# EAGLE schematic Alimentatore_Banco (EAGLE 9.5.0)
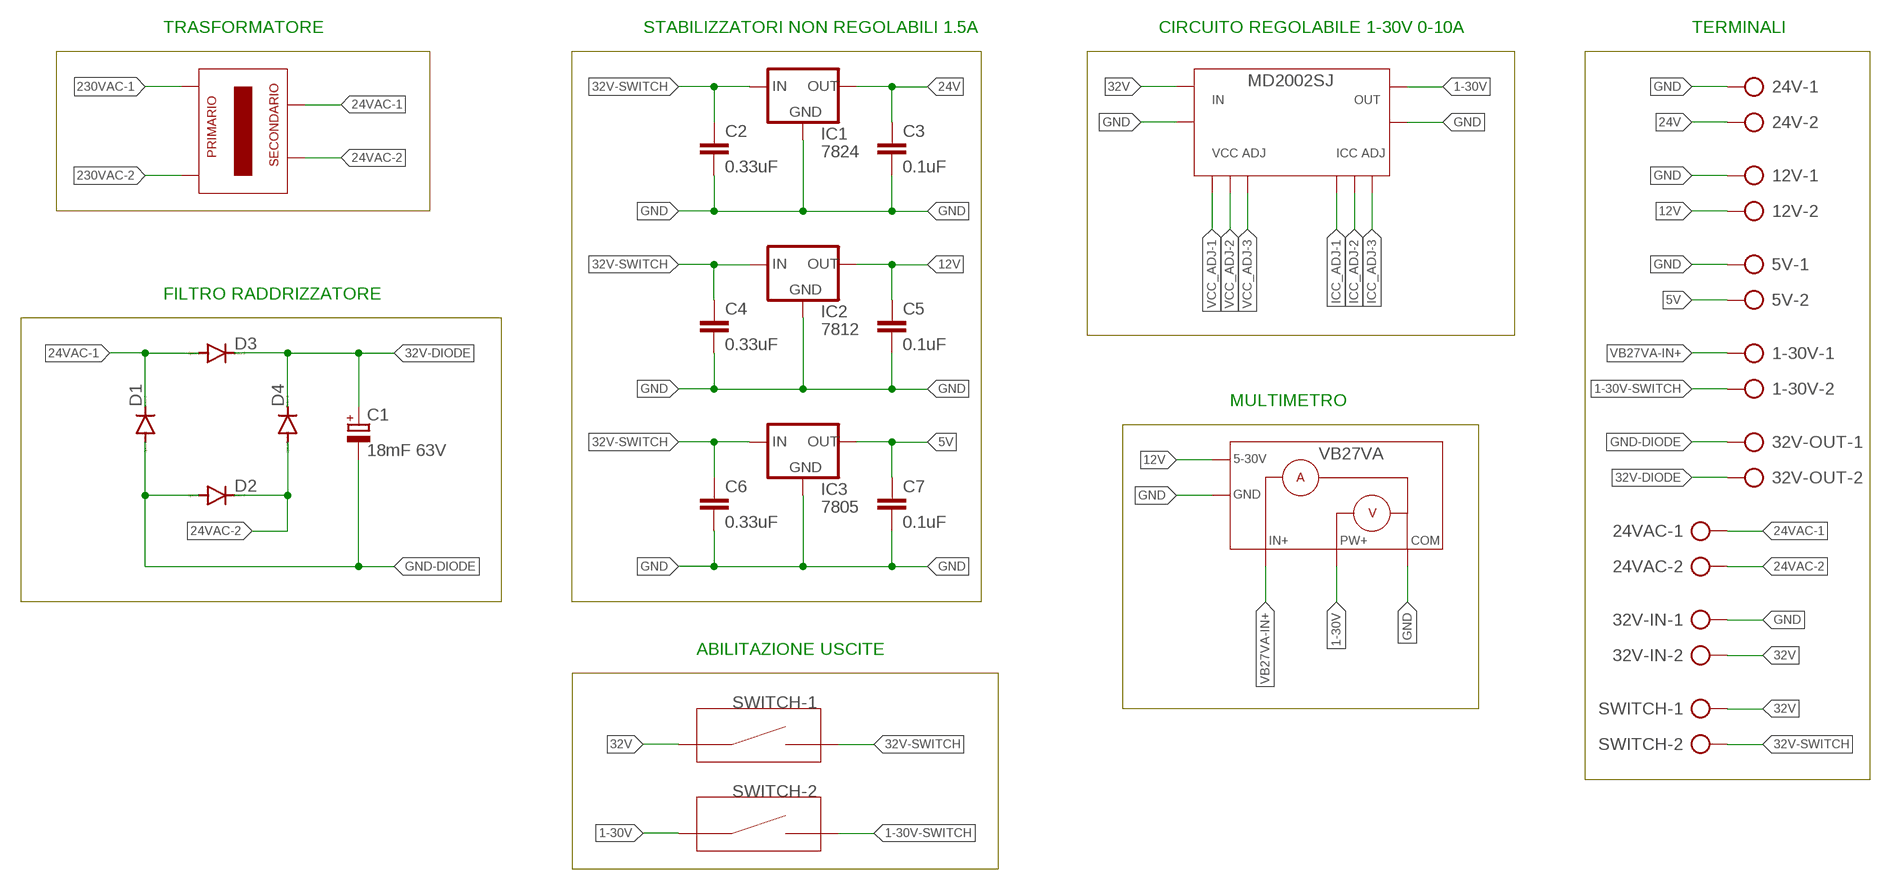
[diagram p0: schematic, sheet 1]

## Parts
1-30V  SMKDSP_1,5/2  [SMKDSP_1,5/2]
5V  SMKDSP_1,5/2  [SMKDSP_1,5/2]
12V  SMKDSP_1,5/2  [SMKDSP_1,5/2]
24V  SMKDSP_1,5/2  [SMKDSP_1,5/2]
24VAC  SMKDSP_1,5/2  [SMKDSP_1,5/2]
32V-IN  SMKDSP_1,5/2  [SMKDSP_1,5/2]
32V-OUT  SMKDSP_1,5/2  [SMKDSP_1,5/2]
C1  18mF 63V  CPOL-EUE5-10.5  [E5-10,5]
C2  0.33uF  C-EU025-025X050  [C025-025X050]
C3  0.1uF  C-EU025-025X050  [C025-025X050]
C4  0.33uF  C-EU025-025X050  [C025-025X050]
C5  0.1uF  C-EU025-025X050  [C025-025X050]
C6  0.33uF  C-EU025-025X050  [C025-025X050]
C7  0.1uF  C-EU025-025X050  [C025-025X050]
D1  BY550  [DO27-15]
D2  BY550  [DO27-15]
D3  BY550  [DO27-15]
D4  BY550  [DO27-15]
IC1  7824  78XXS  [78XXS]
IC2  7812  78XXS  [78XXS]
IC3  7805  78XXS  [78XXS]
SWITCH  SMKDSP_1,5/2  [SMKDSP_1,5/2]

## Nets
1-30V-SWITCH: 1-30V.2
5V: 5V.2 C7.1 IC3.OUT
12V: 12V.2 C5.1 IC2.OUT
24V: 24V.2 C3.1 IC1.OUT
24VAC-1: 24VAC.1 D1.C D3.A
24VAC-2: 24VAC.2 D2.C D4.A
32V: 32V-IN.2 SWITCH.1
32V-DIODE: 32V-OUT.2 C1.+ D3.C D4.C
32V-SWITCH: C2.1 C4.1 C6.1 IC1.IN IC2.IN IC3.IN SWITCH.2
GND: 5V.1 12V.1 24V.1 32V-IN.1 C2.2 C3.2 C4.2 C5.2 C6.2 C7.2 IC1.GND IC2.GND IC3.GND
GND-DIODE: 32V-OUT.1 C1.- D1.A D2.A
VB27VA-IN+: 1-30V.1

## Notes on the sheet
- TRASFORMATORE | STABILIZZATORI NON REGOLABILI 1.5A | CIRCUITO REGOLABILE 1-30V 0-10A | TERMINALI
- MD2002SJ
- IN | OUT
- PRIMARIO | VCC ADJ | ICC ADJ
- SECONDARIO
- FILTRO RADDRIZZATORE
- MULTIMETRO
- VB27VA
- 5-30V
- A
- GND
- V
- IN+ | PW+ | COM
- ABILITAZIONE USCITE
- SWITCH-1
- SWITCH-2

## Library data of the parts
1-30V 5V 12V 24V 24VAC 32V-IN 32V-OUT SWITCH = con-phoenix-smkdsp:SMKDSP_1,5/2: Printklemme, Nennstrom: 17,5 A, Bemessungsspannung: 250 V, Raster: 5,0 mm Source: http://eshop.phoenixcontact.de .. 1733415.pdf; MF: FARNELL; MPN: 1733570; OC_FARNELL: 3041244; OC_NEWARK: 69C8588
C1 = rcl:CPOL-EU: POLARIZED CAPACITOR, European symbol; SPICEPREFIX: C
C2-C7 = rcl:C-EU: CAPACITOR, European symbol; SPICEPREFIX: C
D1-D4 = diode:BY550: DIODE Si200 V, 5 A
IC1-IC3 = v-reg:78XXS: VOLTAGE REGULATOR

## Net classes
0 default: width 0.178 mm
1 vcc: width 0.203 mm